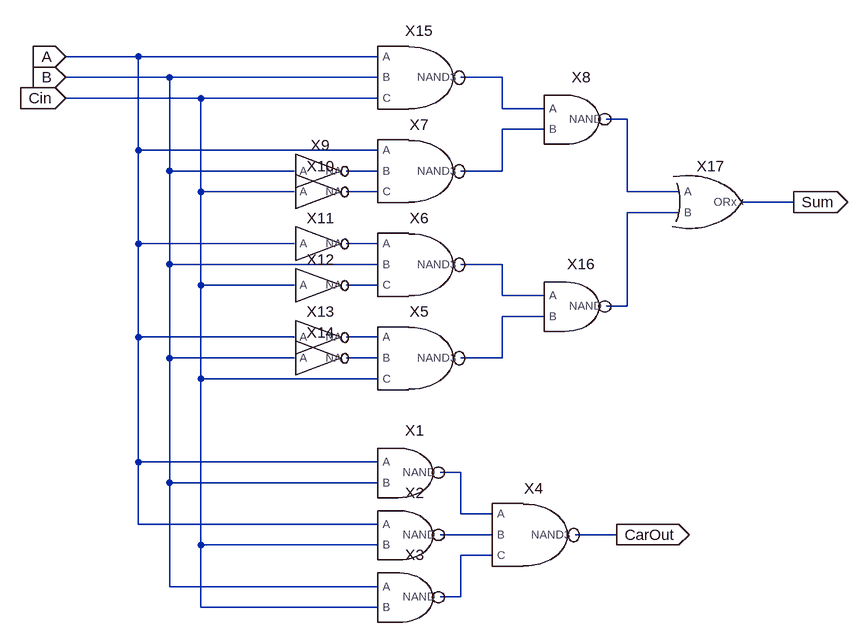
[diagram p0: schematic FullAdder.asc]
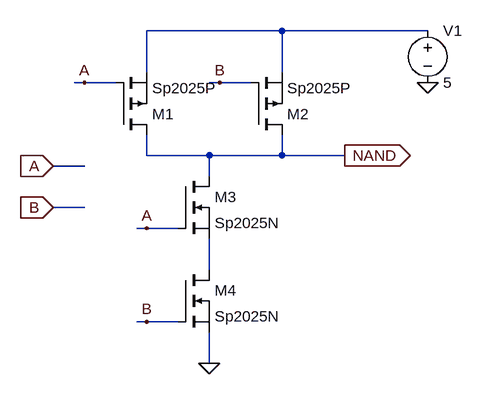
[diagram p1: sub-circuit nand.asc]
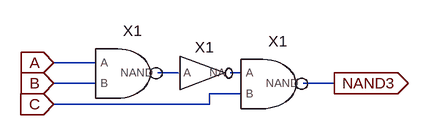
[diagram p2: sub-circuit nand3.asc]
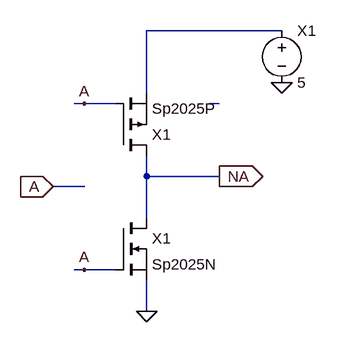
[diagram p3: sub-circuit invert.asc]
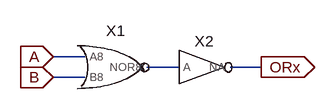
[diagram p4: sub-circuit orx.asc]
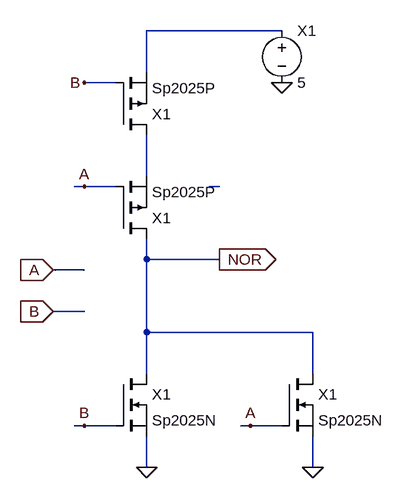
[diagram p5: sub-circuit nor.asc]
FullAdder.asc, the LTspice schematic file:
Version 4.1.1
SHEET 1 928 680
WIRE -192 -560 -304 -560
WIRE 176 -560 -192 -560
WIRE -144 -528 -304 -528
WIRE 176 -528 -144 -528
WIRE 368 -528 304 -528
WIRE -96 -496 -304 -496
WIRE 176 -496 -96 -496
WIRE 368 -480 368 -528
WIRE 432 -480 368 -480
WIRE 560 -464 528 -464
WIRE 432 -448 368 -448
WIRE -192 -416 -192 -560
WIRE 176 -416 -192 -416
WIRE -144 -384 -144 -528
WIRE 48 -384 -144 -384
WIRE 176 -384 128 -384
WIRE 368 -384 368 -448
WIRE 368 -384 304 -384
WIRE -96 -352 -96 -496
WIRE 48 -352 -96 -352
WIRE 176 -352 128 -352
WIRE 560 -352 560 -464
WIRE 640 -352 560 -352
WIRE 816 -336 736 -336
WIRE 640 -320 560 -320
WIRE -192 -272 -192 -416
WIRE 48 -272 -192 -272
WIRE 176 -272 128 -272
WIRE -144 -240 -144 -384
WIRE 176 -240 -144 -240
WIRE 368 -240 304 -240
WIRE -96 -208 -96 -352
WIRE 48 -208 -96 -208
WIRE 176 -208 128 -208
WIRE 368 -192 368 -240
WIRE 432 -192 368 -192
WIRE 560 -176 560 -320
WIRE 560 -176 528 -176
WIRE 432 -160 368 -160
WIRE -192 -128 -192 -272
WIRE 48 -128 -192 -128
WIRE 176 -128 128 -128
WIRE -144 -96 -144 -240
WIRE 48 -96 -144 -96
WIRE 176 -96 128 -96
WIRE 368 -96 368 -160
WIRE 368 -96 304 -96
WIRE -96 -64 -96 -208
WIRE 176 -64 -96 -64
WIRE -192 64 -192 -128
WIRE 176 64 -192 64
WIRE 304 80 272 80
WIRE -144 96 -144 -96
WIRE 176 96 -144 96
WIRE 304 144 304 80
WIRE 352 144 304 144
WIRE -192 160 -192 64
WIRE 176 160 -192 160
WIRE 352 176 272 176
WIRE 544 176 480 176
WIRE -96 192 -96 -64
WIRE 176 192 -96 192
WIRE 352 208 304 208
WIRE -144 256 -144 96
WIRE 176 256 -144 256
WIRE 304 272 304 208
WIRE 304 272 272 272
WIRE -96 288 -96 192
WIRE 176 288 -96 288
FLAG -304 -560 A
IOPIN -304 -560 In
FLAG -304 -528 B
IOPIN -304 -528 In
FLAG -304 -496 Cin
IOPIN -304 -496 In
FLAG 544 176 CarOut
IOPIN 544 176 Out
FLAG 816 -336 Sum
IOPIN 816 -336 Out
SYMBOL NAND 224 80 R0
SYMATTR InstName X1
SYMBOL NAND 224 176 R0
SYMATTR InstName X2
SYMBOL NAND 224 272 R0
SYMATTR InstName X3
SYMBOL NAND3 416 176 R0
SYMATTR InstName X4
SYMBOL NAND3 240 -96 R0
SYMATTR InstName X5
SYMBOL NAND3 240 -240 R0
SYMATTR InstName X6
SYMBOL NAND3 240 -384 R0
SYMATTR InstName X7
SYMBOL INVERT 80 -384 R0
SYMATTR InstName X9
SYMBOL INVERT 80 -352 R0
SYMATTR InstName X10
SYMBOL INVERT 80 -272 R0
SYMATTR InstName X11
SYMBOL INVERT 80 -208 R0
SYMATTR InstName X12
SYMBOL INVERT 80 -128 R0
SYMATTR InstName X13
SYMBOL INVERT 80 -96 R0
SYMATTR InstName X14
SYMBOL NAND3 240 -528 R0
SYMATTR InstName X15
SYMBOL NAND 480 -464 R0
SYMATTR InstName X8
SYMBOL NAND 480 -176 R0
SYMATTR InstName X16
SYMBOL ORx 688 -336 R0
SYMATTR InstName X17

nand.asc, the sub-circuit schematic file:
Version 4.1.1
SHEET 1 880 680
WIRE 336 -160 128 -160
WIRE 560 -160 336 -160
WIRE 128 -96 128 -160
WIRE 336 -96 336 -160
WIRE 32 -80 16 -80
WIRE 80 -80 32 -80
WIRE 240 -80 224 -80
WIRE 288 -80 240 -80
WIRE 128 32 128 0
WIRE 224 32 128 32
WIRE 336 32 336 0
WIRE 336 32 224 32
WIRE 432 32 336 32
WIRE 32 48 -16 48
WIRE 224 64 224 32
WIRE 32 112 -16 112
WIRE 128 144 112 144
WIRE 176 144 128 144
WIRE 224 208 224 160
WIRE 128 288 112 288
WIRE 176 288 128 288
WIRE 224 352 224 304
FLAG 224 352 0
FLAG -16 48 A
IOPIN -16 48 In
FLAG -16 112 B
IOPIN -16 112 In
FLAG 128 144 A
FLAG 128 288 B
FLAG 32 -80 A
FLAG 240 -80 B
FLAG 432 32 NAND
IOPIN 432 32 Out
FLAG 560 -80 0
SYMBOL pmos 80 0 M180
SYMATTR InstName M1
SYMATTR Value Sp2025P
SYMBOL pmos 288 0 M180
SYMATTR InstName M2
SYMATTR Value Sp2025P
SYMBOL nmos 176 64 R0
SYMATTR InstName M3
SYMATTR Value Sp2025N
SYMBOL nmos 176 208 R0
SYMATTR InstName M4
SYMATTR Value Sp2025N
SYMBOL voltage 560 -176 R0
SYMATTR InstName V1
SYMATTR Value 5

nand3.asc, the sub-circuit schematic file:
Version 4
SHEET 1 880 680
WIRE 80 80 16 80
WIRE 208 96 176 96
WIRE 304 96 288 96
WIRE 80 112 16 112
WIRE 448 112 400 112
WIRE 304 128 256 128
WIRE 256 144 256 128
WIRE 256 144 16 144
FLAG 16 80 A
IOPIN 16 80 In
FLAG 16 112 B
IOPIN 16 112 In
FLAG 16 144 C
IOPIN 16 144 In
FLAG 448 112 NAND3
IOPIN 448 112 Out
SYMBOL NAND 128 96 R0
SYMATTR InstName X1
SYMBOL NAND 352 112 R0
SYMATTR InstName X1
SYMBOL INVERT 240 96 R0
SYMATTR InstName X1

invert.asc, the sub-circuit schematic file:
Version 4
SHEET 1 880 680
WIRE 352 -80 144 -80
WIRE 144 16 144 -80
WIRE 48 32 32 32
WIRE 96 32 48 32
WIRE 256 32 240 32
WIRE 144 144 144 112
WIRE 256 144 144 144
WIRE 48 160 0 160
WIRE 144 208 144 144
WIRE 48 288 32 288
WIRE 96 288 48 288
WIRE 144 352 144 304
FLAG 144 352 0
FLAG 0 160 A
IOPIN 0 160 In
FLAG 48 288 A
FLAG 48 32 A
FLAG 256 144 NA
IOPIN 256 144 Out
FLAG 352 0 0
SYMBOL pmos 96 112 M180
SYMATTR InstName X1
SYMATTR Value Sp2025P
SYMBOL nmos 96 208 R0
SYMATTR InstName X1
SYMATTR Value Sp2025N
SYMBOL voltage 352 -96 R0
SYMATTR InstName X1
SYMATTR Value 5

orx.asc, the sub-circuit schematic file:
Version 4.1
SHEET 1 880 680
WIRE 112 128 64 128
WIRE 256 144 208 144
WIRE 384 144 336 144
WIRE 112 160 64 160
FLAG 64 128 A
IOPIN 64 128 In
FLAG 64 160 B
IOPIN 64 160 In
FLAG 384 144 ORx
IOPIN 384 144 Out
SYMBOL NOR 160 144 R0
SYMATTR InstName X1
SYMBOL INVERT 288 144 R0
SYMATTR InstName X2

nor.asc, the sub-circuit schematic file:
Version 4
SHEET 1 880 680
WIRE 432 -320 224 -320
WIRE 224 -256 224 -320
WIRE 176 -240 128 -240
WIRE 224 -96 224 -160
WIRE 128 -80 112 -80
WIRE 176 -80 128 -80
WIRE 336 -80 320 -80
WIRE 224 32 224 0
WIRE 336 32 224 32
WIRE 128 48 80 48
WIRE 128 112 80 112
WIRE 224 144 224 32
WIRE 480 144 224 144
WIRE 224 208 224 144
WIRE 480 208 480 144
WIRE 128 288 112 288
WIRE 176 288 128 288
WIRE 384 288 368 288
WIRE 432 288 384 288
WIRE 224 352 224 304
WIRE 480 352 480 304
FLAG 224 352 0
FLAG 80 48 A
IOPIN 80 48 In
FLAG 80 112 B
IOPIN 80 112 In
FLAG 384 288 A
FLAG 128 288 B
FLAG 128 -80 A
FLAG 128 -240 B
FLAG 336 32 NOR
IOPIN 336 32 Out
FLAG 480 352 0
FLAG 432 -240 0
SYMBOL pmos 176 0 M180
SYMATTR InstName X1
SYMATTR Value Sp2025P
SYMBOL pmos 176 -160 M180
SYMATTR InstName X1
SYMATTR Value Sp2025P
SYMBOL nmos 432 208 R0
SYMATTR InstName X1
SYMATTR Value Sp2025N
SYMBOL nmos 176 208 R0
SYMATTR InstName X1
SYMATTR Value Sp2025N
SYMBOL voltage 432 -336 R0
SYMATTR InstName X1
SYMATTR Value 5

The netlist it stands for:
* FullAdder.asc
XX1 A B N013 nand
XX2 A Cin N014 nand
XX3 B Cin N015 nand
XX4 N013 N014 N015 CarOut nand3
XX5 N011 N012 Cin N010 nand3
XX6 N007 B N009 N008 nand3
XX7 A N004 N005 N003 nand3
XX9 B N004 invert
XX10 Cin N005 invert
XX11 A N007 invert
XX12 Cin N009 invert
XX13 A N011 invert
XX14 B N012 invert
XX15 A B Cin N001 nand3
XX8 N001 N003 N002 nand
XX16 N008 N010 N006 nand
XX17 N002 N006 Sum orx

* block symbol definitions
.subckt nand A B NAND
M1 NAND A N001 N001 Sp2025P
M2 NAND B N001 N001 Sp2025P
M3 NAND A N002 N002 Sp2025N
M4 N002 B 0 0 Sp2025N
V1 N001 0 5
.ends nand

.subckt nand3 A B C NAND3
XX1 A B N001 nand
XX1 N002 C NAND3 nand
XX1 N001 N002 invert
.ends nand3

.subckt invert A NA
M§X1 NA A N001 N001 Sp2025P
M§X1 NA A 0 0 Sp2025N
V§X1 N001 0 5
.ends invert

.subckt orx A B ORx
X§X1 A B N001 nor
X§X2 N001 ORx invert
.ends orx

.subckt nor A8 B8 NOR8
M§X1 NOR A N002 N002 Sp2025P
M§X1 N002 B N001 N001 Sp2025P
M§X1 NOR A 0 0 Sp2025N
M§X1 NOR B 0 0 Sp2025N
V§X1 N001 0 5
.ends nor

.model NMOS NMOS
.model PMOS PMOS
.lib standard.mos
.backanno
.end